# EasyEDA Pro project Osptek RFT TFT Adapter Board.epro

# Schematic Schematic1
Board Name: Board1; Create Date: 2025-10-27; Page Name: P1; Project Name: Ospyek ST7305 Display Driver Board; Schematic Name: Schematic1; Update Date: 2025-10-29; Company: 嘉立创EDA; Page Size: A4; Version: V1.0
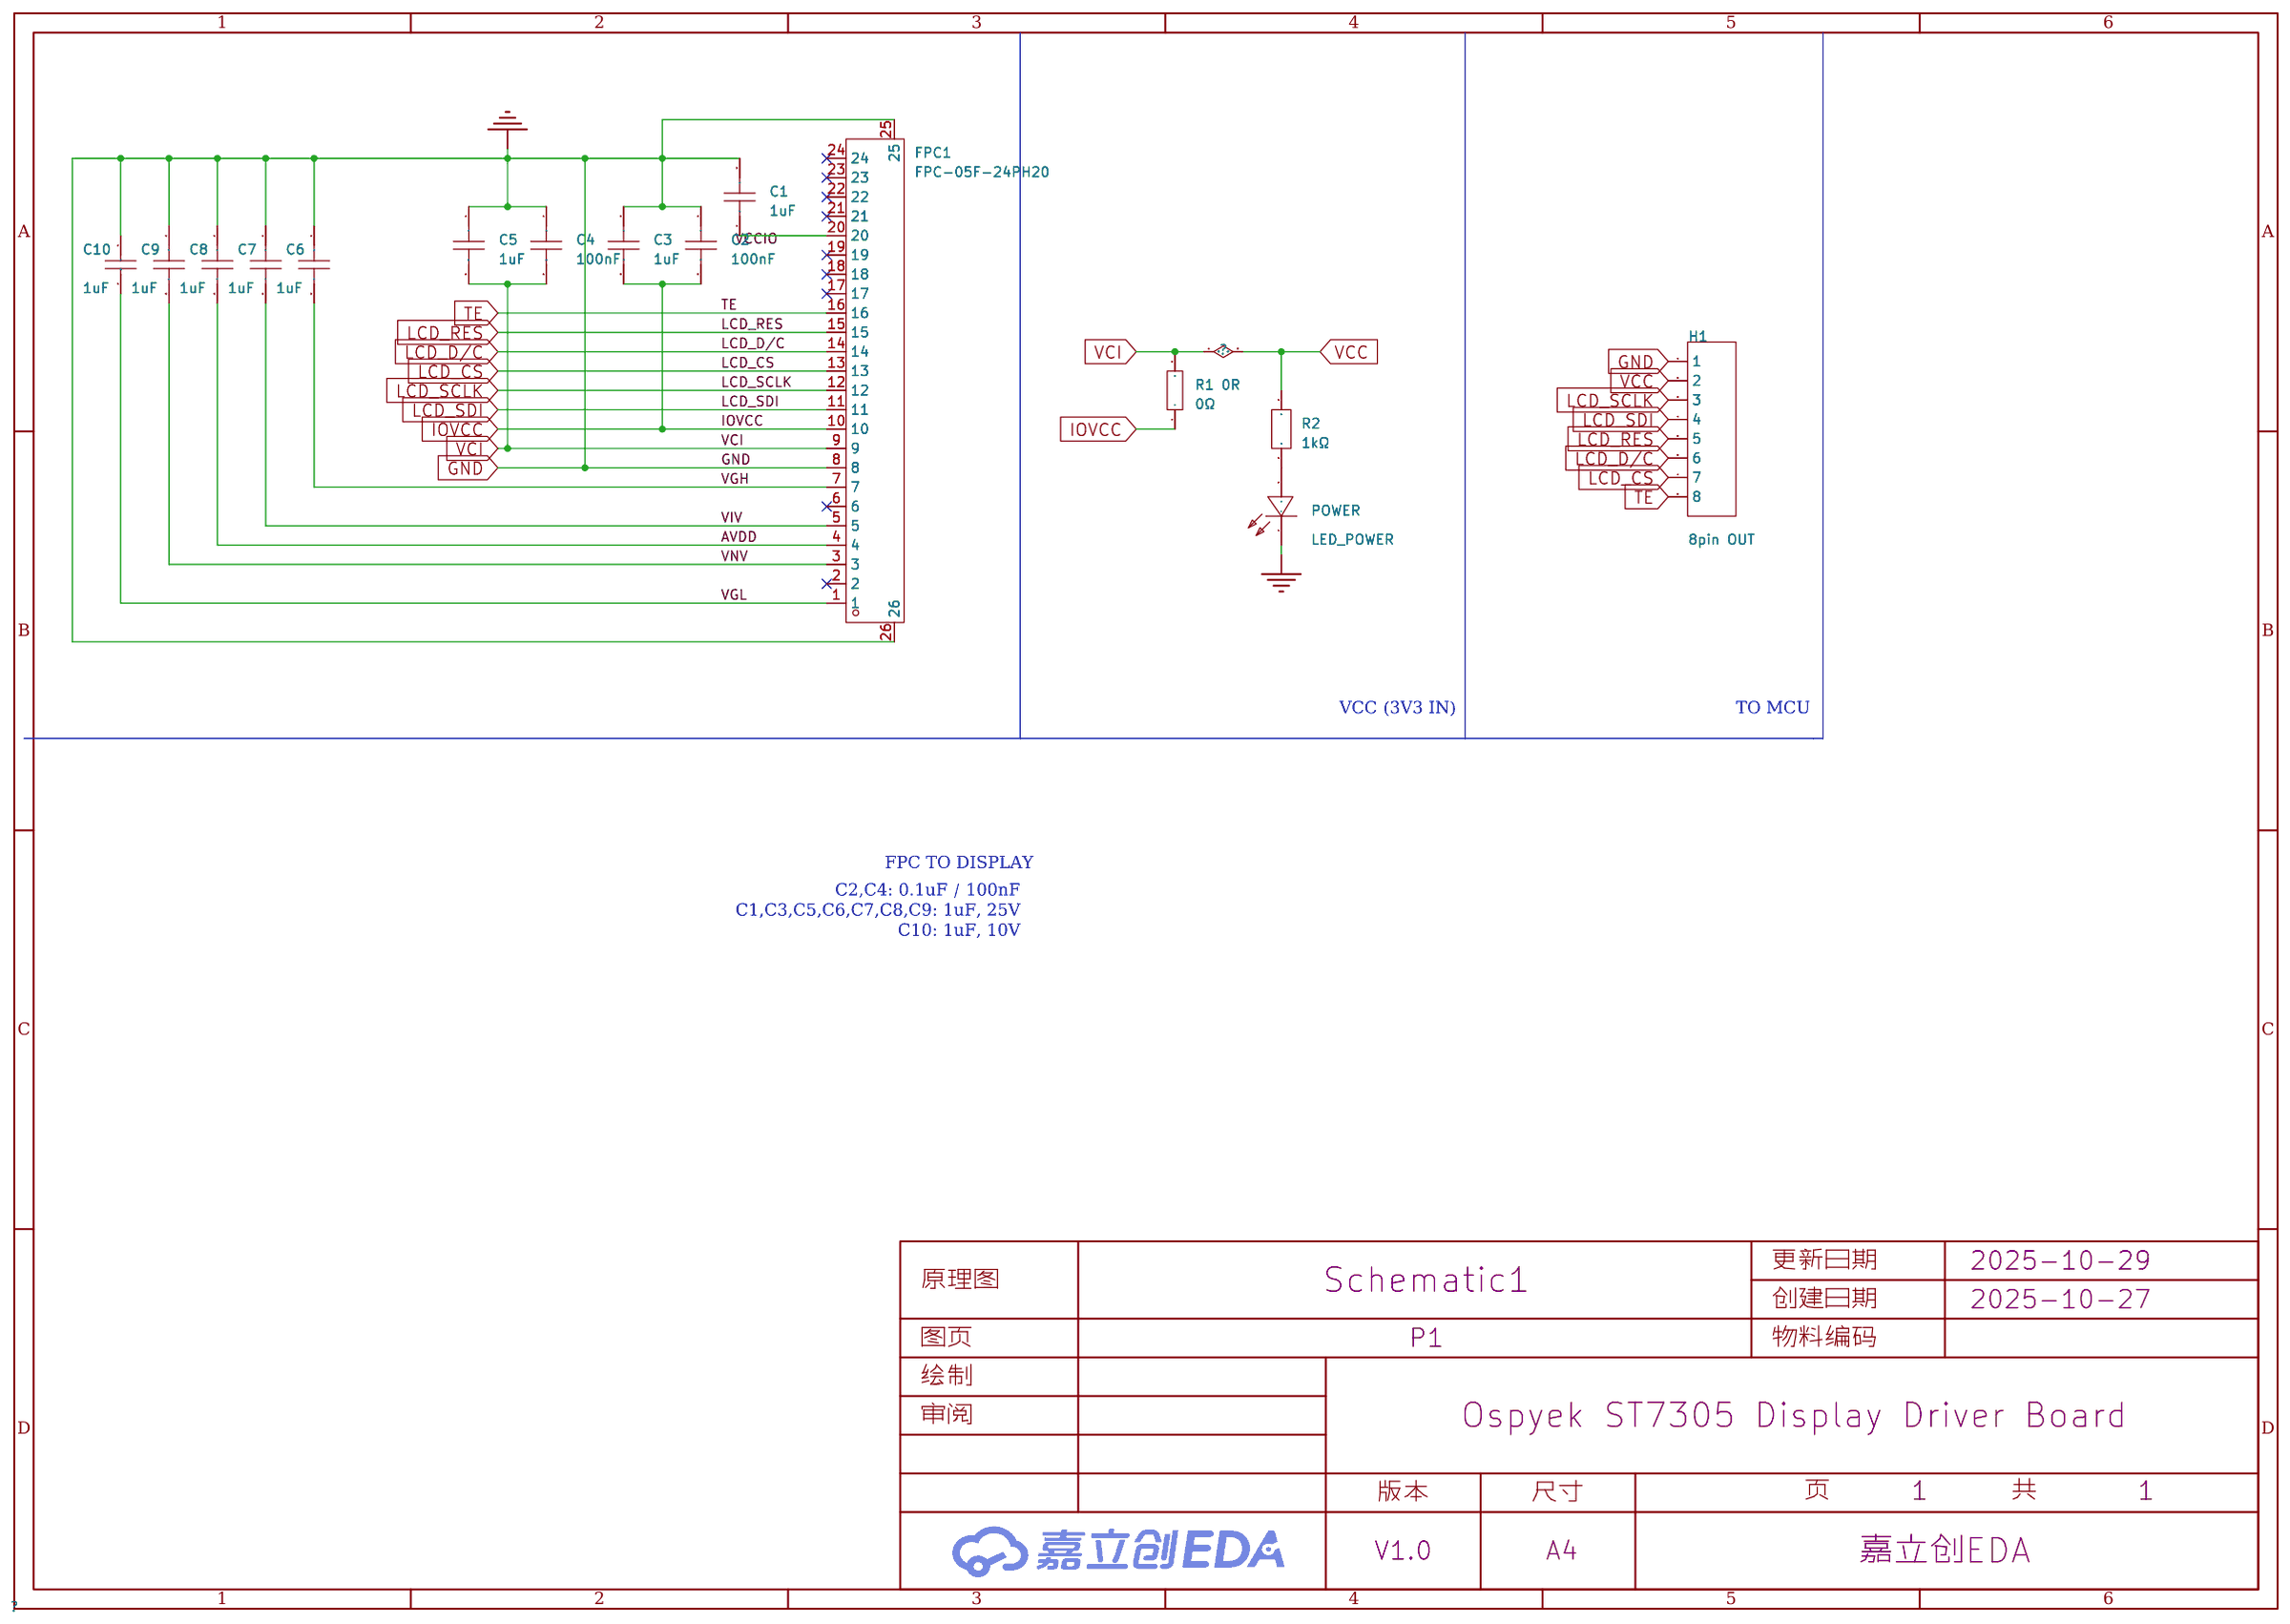
[diagram p0: schematic sheet]

## Parts
C1  1uF  [C0402]
C2  100nF  [C0402]
C3  1uF  [C0402]
C4  100nF  [C0402]
C5  1uF  [C0402]
C6  1uF  [C0402]
C7  1uF  [C0402]
C8  1uF  [C0402]
C9  1uF  [C0402]
C10  1uF  [C0402]
FPC1  FPC-05F-24PH20  [FPC-SMD_24P-P0.50_FPC-05F-24PH20]
H1  8pin OUT  [HDR-TH_8P-P2.54-V-M]
POWER  LED_POWER  [LED0603-RD-YELLOW]
R1 0R  0Ω  [R0805]
R2  1kΩ  [R0805]

## Library data of the parts
C1 C3 C5-C9 = CL05A105KA5NQNC: 容值:1uF;精度:±10%;额定电压:25V;温度系数:X5R;; LCSC Part Name: 1uF ±10% 25V; Supplier Part: C52923; Manufacturer: SAMSUNG(三星); Supplier Footprint: 0402; JLCPCB Part Class: 基础库; Datasheet: https://item.szlcsc.com/datasheet/CL05A105KA5NQNC/53938.html; Supplier: LCSC; Tolerance: ±10%; Voltage Rating: 25V; Temperature Coefficient: X5R
C2 C4 = CL05B104KB54PNC: 容值:100nF;精度:±10%;额定电压:50V;温度系数:X7R;; LCSC Part Name: 100nF ±10% 50V; Supplier Part: C307331; Manufacturer: SAMSUNG(三星); Supplier Footprint: 0402; JLCPCB Part Class: 基础库; Datasheet: https://item.szlcsc.com/datasheet/CL05B104KB54PNC/291005.html; Supplier: LCSC; Tolerance: ±10%; Voltage Rating: 50V; Temperature Coefficient: X7R
C10 = CL05A105KP5NNNC: 容值:1uF;精度:±10%;额定电压:10V;温度系数:X5R;; LCSC Part Name: 1uF ±10% 10V; Supplier Part: C14445; Manufacturer: SAMSUNG(三星); Supplier Footprint: 0402; JLCPCB Part Class: 扩展库; Datasheet: https://item.szlcsc.com/datasheet/CL05A105KP5NNNC/15107.html; Supplier: LCSC; Tolerance: ±10%; Voltage Rating: 10V; Temperature Coefficient: X5R
FPC1 = FPC-05F-24PH20: 锁定特性:翻盖式;触点类型:卧贴;触点数量:24P;间距:0.5mm;安装方式:下接;工作温度:-25℃~+85℃;; LCSC Part Name: 翻盖式 卧贴 P数:24P 间距:0.5mm; Supplier Part: C2856805; Manufacturer: XUNPU(讯普); Supplier Footprint: SMD,P=0.5mm,卧贴; JLCPCB Part Class: 扩展库; Datasheet: https://item.szlcsc.com/datasheet/FPC-05F-24PH20/3056903.html; Supplier: LCSC; Locking Feature: 翻盖式; Contact Type: 卧贴; Number of Contacts: 24P; Pitch: 0.5mm; Mounting Type: 下接; FFC, FCB Thickness: 0.3mm; Height Above Board: 2mm; Contact Material: 磷青铜; Contact Plating: 锡; Operating Temperature: -25℃~+85℃; Rated Voltage (Max): 50V; Current Rating (Max): 500mA
H1 = B-2100S08P-A110: 插针结构:1x8P;间距:2.54mm;行距:-;圆针/方针:-;安装方式:直插;排数:单排;总PIN位数:8P;额定电流:-;额定电压:-;配合针长度:6mm;塑高:2.54mm;端接针长度:3mm;触头材质:黄铜;触头镀层:-;工作温度:-40℃~+105℃;颜色:黑色;; LCSC Part Name: 1x8P 间距:2.54mm 直插; Supplier Part: C124381; Manufacturer: Ckmtw(灿科盟); Supplier Footprint: 插件,P=2.54mm; JLCPCB Part Class: 扩展库; Datasheet: https://item.szlcsc.com/datasheet/B-2100S08P-A110/125656.html; Supplier: LCSC; Pin Structure: 1x8P; Pitch: 2.54mm; Mounting Type: 直插; Number of Rows: 单排; Number of Pins: 8P; Length of Mating Pin: 6mm; Insulation Height: 2.54mm; Length of End Connection Pin: 3mm; Contact Material: 黄铜; Operating Temperature: -40℃~+105℃; Color: 黑色
POWER = LTST-C191KSKT: 发光颜色:黄色;正向压降(Vf):2.1V;功率:75mW;正向电流:20mA;波长:584.5nm~597nm;二极管配置:-;透镜颜色:无色透明透镜;色温:-;发光强度:104mcd;发光角度:130°;载带方式:-;工作温度:-55℃~+85℃;; LCSC Part Name: 黄灯; Supplier Part: C125100; Manufacturer: LITEON(光宝); Supplier Footprint: 0603; JLCPCB Part Class: 扩展库; Datasheet: https://item.szlcsc.com/datasheet/LTST-C191KSKT/136376.html; Supplier: LCSC; Illumination Color: 黄色; Voltage - Forward(Vf): 2.1V; Power(Watts): 75mW; Forward Current: 20mA; Wavelength - Dominant: 584.5nm~597nm; Peak Wavelength: 588nm; Lens Color: 无色透明透镜; Luminous Intensity: 104mcd; Viewing Angle: 130°; Operating Temperature: -55℃~+85℃
R1 0R = 0805W8F0000T5E: 电阻类型:厚膜电阻;阻值:0Ω;精度:±1%;功率:125mW;工作电压:150V;温度系数:±800ppm/℃;; LCSC Part Name: 0Ω ±1% 125mW 厚膜电阻; Supplier Part: C17477; Manufacturer: UNI-ROYAL(厚声); Supplier Footprint: 0805; JLCPCB Part Class: 基础库; Datasheet: https://item.szlcsc.com/datasheet/0805W8F0000T5E/18165.html; Supplier: LCSC; Type: 厚膜电阻; Tolerance: ±1%; Power(Watts): 125mW; Voltage-Supply(Max): 150V; Temperature Coefficient: ±800ppm/℃; Operating Temperature: -55℃~+155℃
R2 = FRR0805J102 TS: 电阻类型:厚膜电阻;阻值:1kΩ;精度:±5%;功率:125mW;工作电压:150V;温度系数:±100ppm/℃;; LCSC Part Name: 厚膜电阻 0805 1KΩ ±5% 125mW; Supplier Part: C49196827; Manufacturer: FOJAN(富捷); Supplier Footprint: 0805; JLCPCB Part Class: 扩展库; Datasheet: https://item.szlcsc.com/datasheet/FRR0805J102%2520TS/51599075.html; Supplier: LCSC; Type: 厚膜电阻; Tolerance: ±5%; Power(Watts): 125mW; Voltage-Supply(Max): 150V; Temperature Coefficient: ±100ppm/℃; Operating Temperature: -55℃~+155℃

## Nets
AVDD: C8.2 FPC1.4
GND: C1.2 C2.1 C3.1 C4.1 C5.1 C6.1 C7.1 C8.1 C9.1 C10.1 FPC1.8 FPC1.25 FPC1.26 H1.1 POWER.1(-)
VCC: C4.2 C5.2 FPC1.9 H1.2 R1 0R.2 R2.2
VCCIO: C1.1 FPC1.20
IOVCC: C2.2 C3.2 FPC1.10 R1 0R.1
LCD_CS: FPC1.13 H1.7
LCD_D/C: FPC1.14 H1.6
LCD_RES: FPC1.15 H1.5
LCD_SCLK: FPC1.12 H1.3
LCD_SDI: FPC1.11 H1.4
TE: FPC1.16 H1.8
VGH: C6.2 FPC1.7
VGL: C10.2 FPC1.1
VIV: C7.2 FPC1.5
VNV: C9.2 FPC1.3
$1N4245: POWER.2(+) R2.1

Not connected (* = marked no-connect by the designer): FPC1 2* 6* 17* 18* 19* 21* 22* 23* 24*

## Notes on the sheet
- VCC (3V3 IN)
- TO MCU
- FPC TO DISPLAY
- C2,C4: 0.1uF / 100nF
  C1,C3,C5,C6,C7,C8,C9: 1uF, 25V
  C10: 1uF, 10V

# Board PCB1
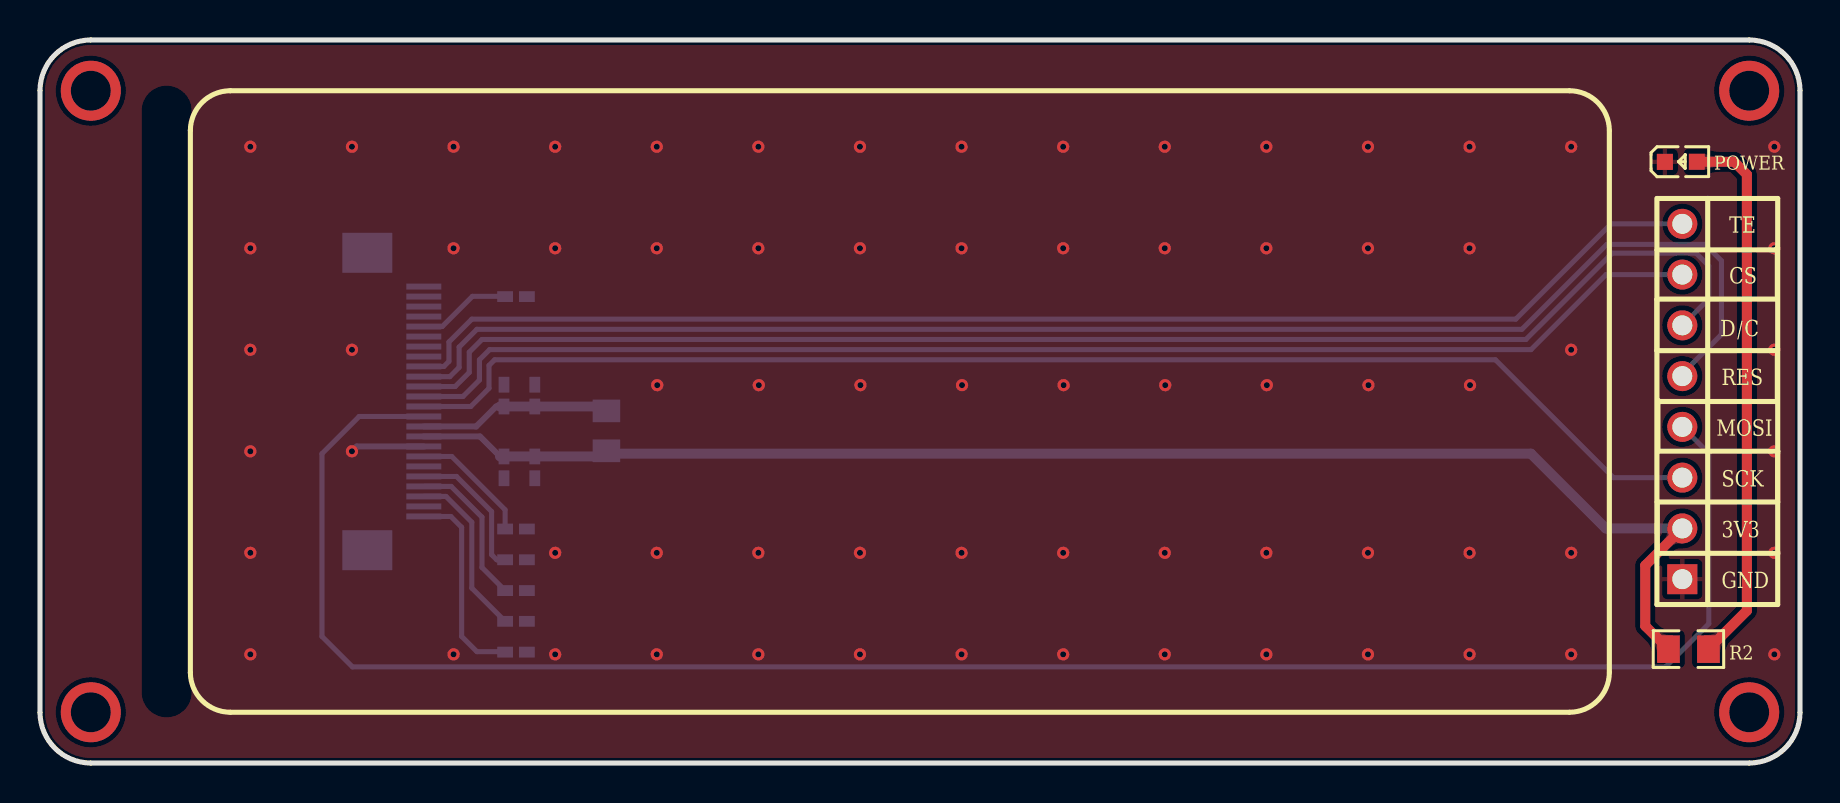
[diagram p1: board, top side]
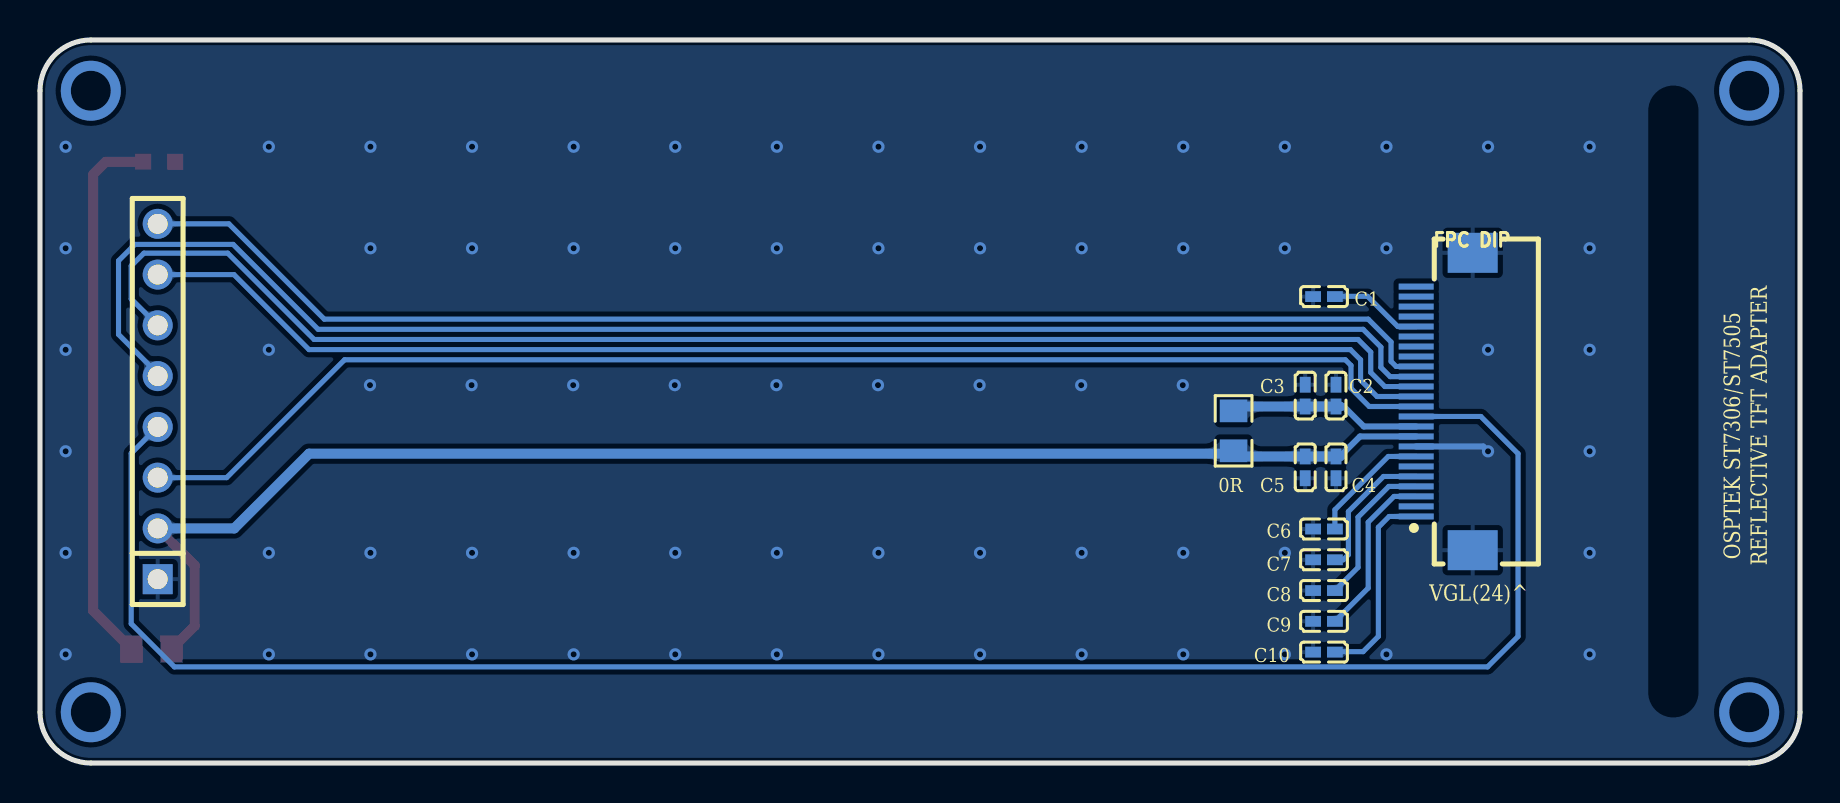
[diagram p2: board, bottom side, seen from below]

Outline 88 x 36.18 mm; copper layers: Top Layer, Bottom Layer. Coordinates in mm from the lower left corner of the outline.
Outline path: 0,33.64 0,2.54 arc(0.74,0.74) 2.54,0 85.46,0 arc(87.26,0.74) 88,2.54 88,33.64 arc(87.26,35.44) 85.46,36.18 2.54,36.18 arc(0.74,35.44) 0,33.64
Stack: Top Layer 0.035mm / Dielectric1 1.51mm FR4 er 4.5 / Bottom Layer 0.035mm

## Design rules (mm)
template: JLCPCB Capability(Two Layers Board)
spacing copperThickness1oz (default): track to track 0.102, other pairs 0.152 to 0.3
spacing copperThickness2oz: track to track 0.203, other pairs 0.152 to 0.3
track width copperThickness1oz (default): min 0.127, default 0.254, max 2.54
track width copperThickness2oz: min 0.203, default 0.254, max 2.54
differential pair differentialPair (default): width min 0.127, default 0.254, max 2.54; gap min 0.152, default 0.152
via viaSize (default): diameter min 0.5, default 0.61, max 10; hole min 0.3, default 0.305, max 6.3

## Placement (name value [footprint] x y rotation side)
0R  -  [R0805]  28.32 16.62 270 bottom
C1  1uF  [C0402]  23.8 23.34 0 bottom
C2  100nF  [C0402]  23.2 18.39 270 bottom
C3  1uF  [C0402]  24.74 18.39 270 bottom
C4  100nF  [C0402]  23.2 14.8 90 bottom
C5  1uF  [C0402]  24.74 14.8 90 bottom
C6  1uF  [C0402]  23.8 11.71 180 bottom
C7  1uF  [C0402]  23.8 10.17 180 bottom
C8  1uF  [C0402]  23.8 8.63 180 bottom
C9  1uF  [C0402]  23.8 7.09 180 bottom
C10  1uF  [C0402]  23.8 5.55 180 bottom
FPC DIP
  -  [FPC-SMD_24P-P0.50_FPC-05F-24PH20]  17.65 18.09 90 bottom
H1  8pin OUT  [HDR-TH_8P-P2.54-V-M]  82.12 18.09 90 bottom
POWER  LED_POWER  [LED0603-RD-YELLOW]  82.04 30.08 0 top
R2  1kΩ  [R0805]  82.42 5.7 180 top

## Footprints (pads in the part's own frame, mm; a bottom-side part is the same pattern mirrored in y, then rotated)
C0402
  rect 0.79x0.54 smd: 1(-0.545,0) 2(0.545,0)
FPC-SMD_24P-P0.50_FPC-05F-24PH20
  rect 0.3x1.75 smd: 1(-5.753,1.536) 2(-5.25,1.537) 3(-4.75,1.537) 4(-4.25,1.537) 5(-3.75,1.537) 6(-3.25,1.537) 7(-2.75,1.537) 8(-2.25,1.537) 9(-1.75,1.537) 10(-1.25,1.537) 11(-0.75,1.537) 12(-0.25,1.537) 13(0.25,1.537) 14(0.75,1.537) 15(1.244,1.537) 16(1.752,1.537) 17(2.25,1.537) 18(2.75,1.537) 19(3.25,1.537) 20(3.75,1.537) 21(4.25,1.537) 22(4.75,1.537) 23(5.25,1.537) 24(5.75,1.537)
  rect 2x2.5 smd: 25(7.44,-1.288) 26(-7.44,-1.288)
HDR-TH_8P-P2.54-V-M
  rect 1.5x1.5 hole 1: 1(-8.89,0)
  round 1.5 hole 1: 2(-6.35,0) 3(-3.81,0) 4(-1.27,0) 5(1.27,0) 6(3.81,0) 7(6.35,0) 8(8.89,0)
LED0603-RD-YELLOW
  rect 0.8x0.8 smd: 1(-0.799,-0.004) 2(0.799,0.004)
R0805
  rect 1.133x1.377 smd: 1(-1,0) 2(1,0)

## Nets
AVDD: C8.2 FPC DIP
.4
GND: C1.2 C2.1 C3.1 C4.1 C5.1 C6.1 C7.1 C8.1 C9.1 C10.1 FPC DIP
.8 FPC DIP
.25 FPC DIP
.26 H1.1 POWER.1
VCC: 0R.2 C4.2 C5.2 FPC DIP
.9 H1.2 R2.2
VCCIO: C1.1 FPC DIP
.20
IOVCC: 0R.1 C2.2 C3.2 FPC DIP
.10
LCD_CS: FPC DIP
.13 H1.7
LCD_D/C: FPC DIP
.14 H1.6
LCD_RES: FPC DIP
.15 H1.5
LCD_SCLK: FPC DIP
.12 H1.3
LCD_SDI: FPC DIP
.11 H1.4
TE: FPC DIP
.16 H1.8
VGH: C6.2 FPC DIP
.7
VGL: C10.2 FPC DIP
.1
VIV: C7.2 FPC DIP
.5
VNV: C9.2 FPC DIP
.3
$1N4245: POWER.2 R2.1

Pads without a net: FPC DIP
 2 6 17 18 19 21 22 23 24

## Via types
v1: diameter 3, hole 2, Top Layer to Bottom Layer, 4 vias
v2: diameter 0.61, hole 0.305, Top Layer to Bottom Layer, 71 vias

## Routing (per net, layer and track width the routed paths; a pad name or vN(x,y) marks a point on that pad's centre or on a via; arc(x,y) is an arc through that point)
AVDD: length 7.7
  Bottom Layer w0.254: C8.2 22.1,9.79 22.1,12.3 20.56,13.84 FPC DIP
.4
GND: length 3.7
  Bottom Layer w0.3: FPC DIP
.8 15.84,15.84 v2(15.6,15.6)
  vias: v2(10.52,30.84) v2(10.52,25.76) v2(10.52,20.68) v2(10.52,15.6) v2(10.52,10.52) v2(10.52,5.44) v2(15.6,30.84) v2(15.6,20.68) v2(20.68,30.84) v2(20.68,25.76) v2(20.68,5.44) v2(25.76,30.84) v2(25.76,25.76) v2(25.76,10.52) v2(25.76,5.44) v2(30.84,30.84) v2(30.84,25.76) v2(30.84,10.52) v2(30.84,5.44) v2(30.86,18.91) v2(35.92,30.84) v2(35.92,25.76) v2(35.94,18.91) v2(35.92,10.52) v2(35.92,5.44) v2(41,30.84) v2(41,25.76) v2(41.02,18.91) v2(41,10.52) v2(41,5.44) v2(46.08,30.84) v2(46.08,25.76) v2(46.1,18.91) v2(46.08,10.52) v2(46.08,5.44) v2(51.16,30.84) v2(51.16,25.76) v2(51.18,18.91) v2(51.16,10.52) v2(51.16,5.44) v2(56.24,30.84) v2(56.24,25.76) v2(56.24,10.52) v2(56.24,5.44) v2(56.26,18.91) v2(61.32,30.84) v2(61.32,25.76) v2(61.34,18.91) v2(61.32,10.52) v2(61.32,5.44) v2(66.4,30.84) v2(66.4,25.76) v2(66.42,18.91) v2(66.4,10.52) v2(66.4,5.44) v2(71.48,30.84) v2(71.48,25.76) v2(71.5,18.91) v2(71.48,10.52) v2(71.48,5.44) v2(76.56,30.84) v2(76.56,20.68) v2(76.56,10.52) v2(76.56,5.44) v2(86.72,30.84) v2(86.72,25.76) v2(86.72,20.68) v2(86.72,15.6) v2(86.72,10.52) v2(86.72,5.44)
VCC: length 72.3
  Top Layer w0.5: R2.2 80.26,6.86 80.26,9.89 82.11,11.74
  Bottom Layer w0.3: 23,15.34 22,16.34 FPC DIP
.9
  Bottom Layer w0.5: H1.2 78.29,11.74 74.55,15.48 28.46,15.48 0R.2 28.04,15.34 23,15.34
VCCIO: length 4.7
  Bottom Layer w0.254: FPC DIP
.20 20.11,21.84 21.62,23.35 23.24,23.35 C1.1
(no net):
  vias: v1(2.54,33.64) v1(2.54,2.54) v1(85.46,33.64) v1(85.46,2.54)
IOVCC: length 9.6
  Bottom Layer w0.3: 23,17.84 22.81,17.84 21.81,16.84 FPC DIP
.10
  Bottom Layer w0.5: 23,17.84 C3.2 28.1,17.84 0R.1
LCD_CS: length 66
  Bottom Layer w0.254: H1.7 78.3,24.44 74.55,20.69 22.48,20.69 21.97,20.18 21.97,19.16 21.15,18.34 FPC DIP
.13
LCD_D/C: length 71.4
  Bottom Layer w0.254: H1.6 83.44,23.22 83.44,24.88 82.8,25.51 78.61,25.51 74.29,21.19 22.1,21.19 21.46,20.56 21.46,19.54 20.76,18.84 FPC DIP
.14
LCD_RES: length 75.1
  Bottom Layer w0.254: FPC DIP
.15 20.49,19.33 20.95,19.8 20.95,20.81 21.84,21.7 74.09,21.7 78.34,25.95 83.25,25.95 84.07,25.13 84.07,21.45 82.12,19.49 H1.5
LCD_SCLK: length 67
  Bottom Layer w0.254: H1.3 78.67,14.28 72.77,20.18 22.73,20.18 22.45,19.9 22.45,18.75 21.54,17.84 FPC DIP
.12
LCD_SDI: length 96.3
  Bottom Layer w0.254: H1.4 83.44,15.5 83.44,6.97 81.28,4.81 15.62,4.81 14.1,6.34 14.1,15.48 15.96,17.34 FPC DIP
.11
TE: length 66.4
  Bottom Layer w0.254: H1.8 78.56,26.98 73.79,22.21 21.59,22.21 20.45,21.07 20.45,20.1 20.19,19.84 FPC DIP
.16
VGH: length 6.1
  Bottom Layer w0.254: FPC DIP
.7 20.59,15.34 23.25,12.67 C6.2
VGL: length 10.1
  Bottom Layer w0.254: FPC DIP
.1 20.54,12.34 21.08,11.8 21.08,6.34 21.84,5.57 23.23,5.57 C10.2
VIV: length 7.1
  Bottom Layer w0.254: FPC DIP
.5 20.82,14.34 22.58,12.58 22.58,10.42 22.83,10.17 C7.2
VNV: length 8.6
  Bottom Layer w0.254: FPC DIP
.3 20.3,13.34 21.59,12.05 21.59,8.76 C9.2
$1N4245: length 27.3
  Top Layer w0.5: R2.1 85.34,7.62 85.34,29.45 84.71,30.08 82.84,30.08 POWER.2

## Copper pours and planes (outline as drawn; the poured copper is in the pictures)
GND on Top Layer: -12.32,53.96 95,53.96 95,-7.38 -12.32,-7.38
GND on Top Layer: -20.83,43.93 111.38,43.93 111.38,-19.32 -20.83,-19.32
GND on Bottom Layer: -8.13,39.23 100.58,39.23 100.58,-15.38 -8.13,-15.38

Small or netless copper shapes (teardrops, artwork), in the pictures only: 4 on Top Layer, 26 on Bottom Layer

## Text on the board
Bottom Silkscreen Layer: i4N | OSPTEK ST7306/ST7505 / REFLECTIVE TFT ADAPTER | VGL(24)^
Document Layer: PCB Width = FR-4 width + EVA form width / = 2.6mm | Length of FPC inserted in the dip / = 3.5mm | MAX Avaliable FPC length / = 14.3 - (3.14*2.6*0.5) - 3.5 / = 6.718mm | MIN Avaliable FPC length is when the / radius  = 2mm, as it's the length of the / open area. / Result: 4.52mm | (MAX+MIN)/2 = 5.619mm / Take this as the FPC length for application
Top Silkscreen Layer: MOSI | D/C | RES | SCK | 3V3 | GND | TE | CS
